# Altium project Lab6_Voloschuk.PrjPcb
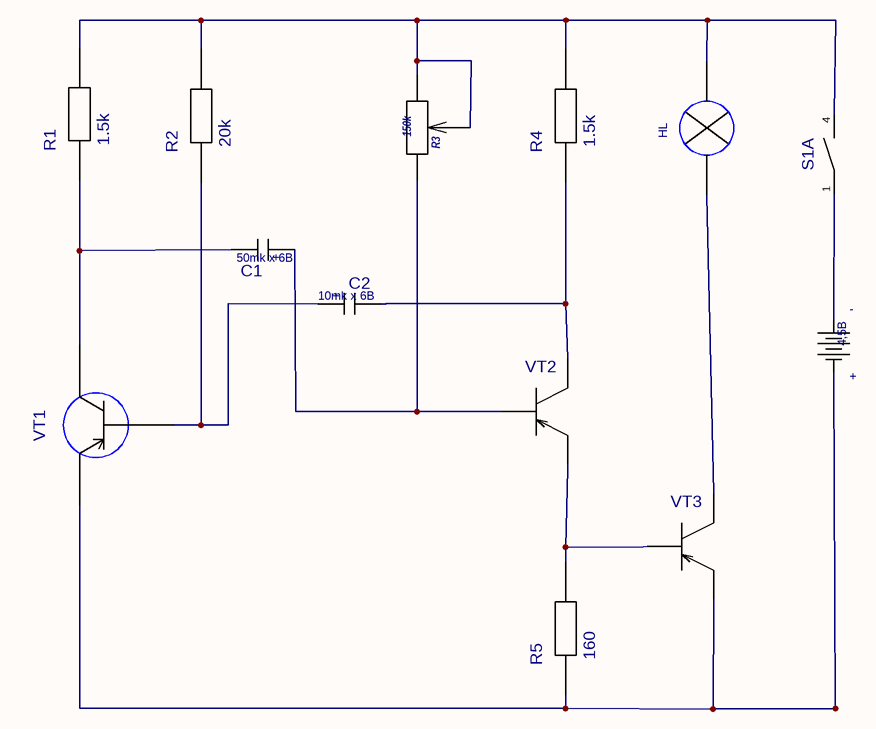
[diagram p0: Sheet1.SCHDOC]
1 sheet, 13 parts. Net scope: global (net labels, ports and power ports of the same name join across sheets).

## Sheet Sheet1.SCHDOC
size 420 x 297 mm; SheetNumber: 1; SheetTotal: 1; DocumentName: Sheet1.SCHDOC

### Parts
B1  value 4,5B  [BATAR]  (hidden comment: BATAR)
C1  value 50mk x 6B  [CAP2]  (hidden comment: CAP2)
C2  value 10mk x 6B  [CAP2]  (hidden comment: CAP2)
HL  HL  [HL]  (value not drawn)
R1  value 1.5k  [SMD_08_05]  (hidden comment: RES_08_05)
R2  value 20k  [SMD_08_05]  (hidden comment: RES_08_05)
R3  value 150k  [СП3-38В]  (hidden comment: СП3-38В)
R4  value 1.5k  [SMD_08_05]  (hidden comment: RES_08_05)
R5  value 160  [SMD_08_05]  (hidden comment: RES_08_05)
S1  БДМ1-2  [BDM1-2]  (value not drawn)  (part A of 2)
VT1  КТ361  [КТ315]  (value not drawn)
VT2  KT816  [KT27]  (value not drawn)
VT3  KT816  [KT27]  (value not drawn)

### Nets
NetB1_1: B1.1(PLUS) S1.1(I/O1)
NetB1_2: B1.2(MINUS) R5.1 VT1.3(A3) VT3.1(E)
NetC1_1: C1.1 R3.2 VT2.2(B)
NetC1_2: C1.2 R1.1 VT1.2(A2)
NetC2_1: C2.1 R2.1 VT1.1(A1)
NetC2_2: C2.2 R4.1 VT2.3(K)
NetHL_1: HL.1 VT3.3(K)
NetHL_2: HL.2 R1.2 R2.2 R3.1 R3.3 R4.2 S1.4(I/O2)
NetR5_2: R5.2 VT2.1(E) VT3.2(B)

### Notes on the sheet
- (near B1) -
- (near B1) +
- (in symbol CAP2) +

### Library data of the parts
S1 = БДМ1-2: Value: *
VT2 VT3 = KT816: Value: *